# Altium schematic sheet BackplaneConnector.SchDoc
size A4; DocumentNumber: 1; SheetNumber: 1; SheetTotal: 4; PageSetup: Record=PageOptions|CenterHorizontal=True|CenterVertical=True|PrintScale=0.97|XCorrection=1.00|YCorrection=1.00|PrintKind=1|BorderSize=5000000|LeftOffset=0|BottomOffset=0|Orientation=2|PaperLength=2970|PaperWidth=2100|Scale=100|PaperSource=7|PrintQuality=600|MediaType=1|DitherType=10|PaperKind=A4|PrintScaleMode=1
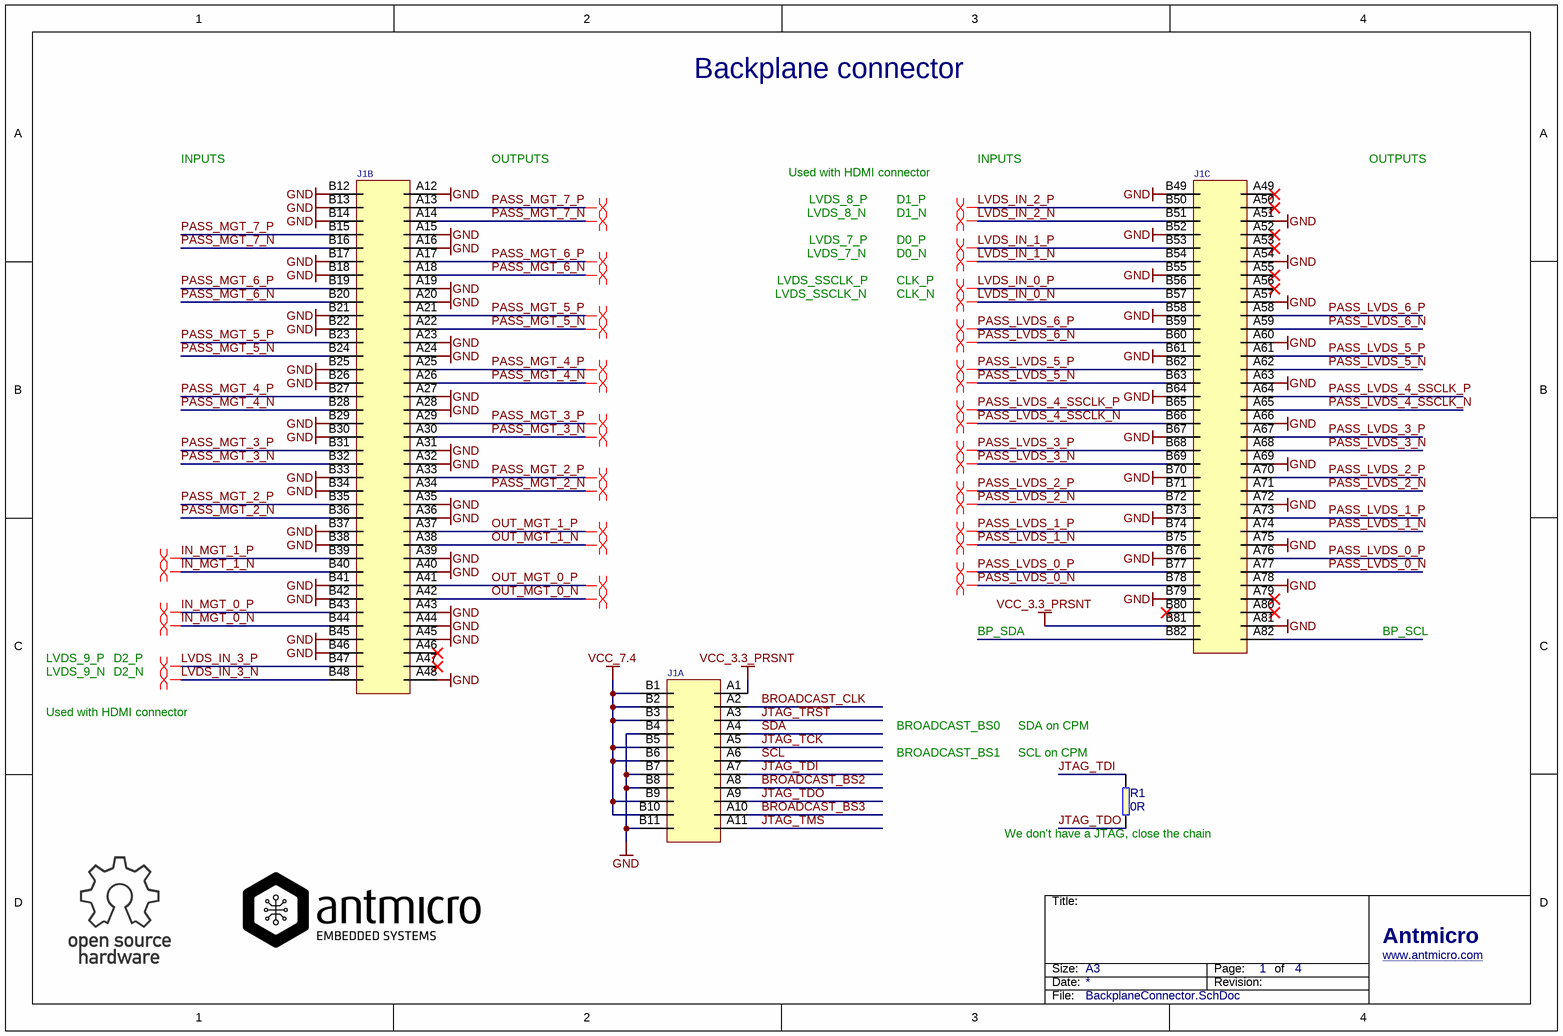
[diagram p0: BackplaneConnector.SchDoc]

## Parts
J1  (no value)  [PCIEX16]  (parts A,B,C of 3)  (no BOM)
R1  0R  [0402]

## Nets
GND: J1.A12 J1.A15 J1.A16 J1.A19 J1.A20 J1.A23 J1.A24 J1.A27 J1.A28 J1.A31 J1.A32 J1.A35 J1.A36 J1.A39 J1.A40 J1.A43 J1.A44 J1.A45 J1.A48 J1.A51 J1.A54 J1.A57 J1.A60 J1.A63 J1.A66 J1.A69 J1.A72 J1.A75 J1.A78 J1.A81 J1.B4 J1.B7 J1.B8 J1.B11 J1.B12 J1.B13 J1.B14 J1.B17 J1.B18 J1.B21 J1.B22 J1.B25 J1.B26 J1.B29 J1.B30 J1.B33 J1.B34 J1.B37 J1.B38 J1.B41 J1.B42 J1.B45 J1.B46 J1.B49 J1.B52 J1.B55 J1.B58 J1.B61 J1.B64 J1.B67 J1.B70 J1.B73 J1.B76 J1.B79
VCC_3.3_PRSNT: J1.A1 J1.B81
VCC_7.4: J1.B1 J1.B2 J1.B3 J1.B5 J1.B6 J1.B9 J1.B10
BROADCAST_BS2: J1.A8
BROADCAST_BS3: J1.A10
BROADCAST_CLK: J1.A2
IN_MGT_0_N: J1.B44
IN_MGT_0_P: J1.B43
IN_MGT_1_N: J1.B40
IN_MGT_1_P: J1.B39
JTAG_~{TRST}: J1.A3
JTAG_TCK: J1.A5
JTAG_TDI: J1.A7 R1.2
JTAG_TDO: J1.A9 R1.1
JTAG_TMS: J1.A11
LVDS_IN_0_N: J1.B57
LVDS_IN_0_P: J1.B56
LVDS_IN_1_N: J1.B54
LVDS_IN_1_P: J1.B53
LVDS_IN_2_N: J1.B51
LVDS_IN_2_P: J1.B50
LVDS_IN_3_N: J1.B48
LVDS_IN_3_P: J1.B47
OUT_MGT_0_N: J1.A42
OUT_MGT_0_P: J1.A41
OUT_MGT_1_N: J1.A38
OUT_MGT_1_P: J1.A37
PASS_LVDS_0_N: J1.A77 J1.B78
PASS_LVDS_0_P: J1.A76 J1.B77
PASS_LVDS_1_N: J1.A74 J1.B75
PASS_LVDS_1_P: J1.A73 J1.B74
PASS_LVDS_2_N: J1.A71 J1.B72
PASS_LVDS_2_P: J1.A70 J1.B71
PASS_LVDS_3_N: J1.A68 J1.B69
PASS_LVDS_3_P: J1.A67 J1.B68
PASS_LVDS_4_SSCLK_N: J1.A65 J1.B66
PASS_LVDS_4_SSCLK_P: J1.A64 J1.B65
PASS_LVDS_5_N: J1.A62 J1.B63
PASS_LVDS_5_P: J1.A61 J1.B62
PASS_LVDS_6_N: J1.A59 J1.B60
PASS_LVDS_6_P: J1.A58 J1.B59
PASS_MGT_2_N: J1.A34 J1.B36
PASS_MGT_2_P: J1.A33 J1.B35
PASS_MGT_3_N: J1.A30 J1.B32
PASS_MGT_3_P: J1.A29 J1.B31
PASS_MGT_4_N: J1.A26 J1.B28
PASS_MGT_4_P: J1.A25 J1.B27
PASS_MGT_5_N: J1.A22 J1.B24
PASS_MGT_5_P: J1.A21 J1.B23
PASS_MGT_6_N: J1.A18 J1.B20
PASS_MGT_6_P: J1.A17 J1.B19
PASS_MGT_7_N: J1.A14 J1.B16
PASS_MGT_7_P: J1.A13 J1.B15
SCL: J1.A6
SDA: J1.A4

Not connected (* = marked no-connect by the designer): J1 A46* A47* A49* A50* A52* A53* A55* A56* A79* A80* A82 B80* B82

## Layout directives
differential pair: IN_MGT_0_N, IN_MGT_0_P, IN_MGT_1_N, IN_MGT_1_P, LVDS_IN_0_N, LVDS_IN_0_P, LVDS_IN_1_N, LVDS_IN_1_P, LVDS_IN_2_N, LVDS_IN_2_P, LVDS_IN_3_N, LVDS_IN_3_P, OUT_MGT_0_N, OUT_MGT_0_P, OUT_MGT_1_N, OUT_MGT_1_P, PASS_LVDS_0_N, PASS_LVDS_0_P, PASS_LVDS_1_N, PASS_LVDS_1_P, PASS_LVDS_2_N, PASS_LVDS_2_P, PASS_LVDS_3_N, PASS_LVDS_3_P, PASS_LVDS_4_SSCLK_N, PASS_LVDS_4_SSCLK_P, PASS_LVDS_5_N, PASS_LVDS_5_P, PASS_LVDS_6_N, PASS_LVDS_6_P, PASS_MGT_2_N, PASS_MGT_2_P, PASS_MGT_3_N, PASS_MGT_3_P, PASS_MGT_4_N, PASS_MGT_4_P, PASS_MGT_5_N, PASS_MGT_5_P, PASS_MGT_6_N, PASS_MGT_6_P, PASS_MGT_7_N, PASS_MGT_7_P

## Notes on the sheet
- Backplane connector
- INPUTS
- OUTPUTS
- Used with HDMI connector
- LVDS_8_N
- LVDS_8_P
- LVDS_7_P
- D1_N
- D1_P
- D0_P
- LVDS_SSCLK_N
- LVDS_SSCLK_P
- LVDS_7_N
- CLK_N
- CLK_P
- D0_N
- BP_SDA
- BP_SCL
- LVDS_9_P
- LVDS_9_N
- D2_P
- D2_N
- BROADCAST_BS0
- BROADCAST_BS1
- SDA on CPM
- SCL on CPM
- (near R1) We don't have a JTAG, close the chain
- Title:
- Size:
- Date:
- A3
- Revision:
- Page:
- of
- Antmicro
- www.antmicro.com
- File:

## Library data of the parts
J1 = PCIEX16: PCB Only; Part Number: PCIEX16; Manufacturer: PCB ONLY; Part Symbol: PCB ONLY
R1 = R_0R_0402: SMT Resistor 0402; Manufacturer: MULTICOMP; Part Symbol: MCMR04X000 PTL; Value: 0R; Part Number: R_0R_0402